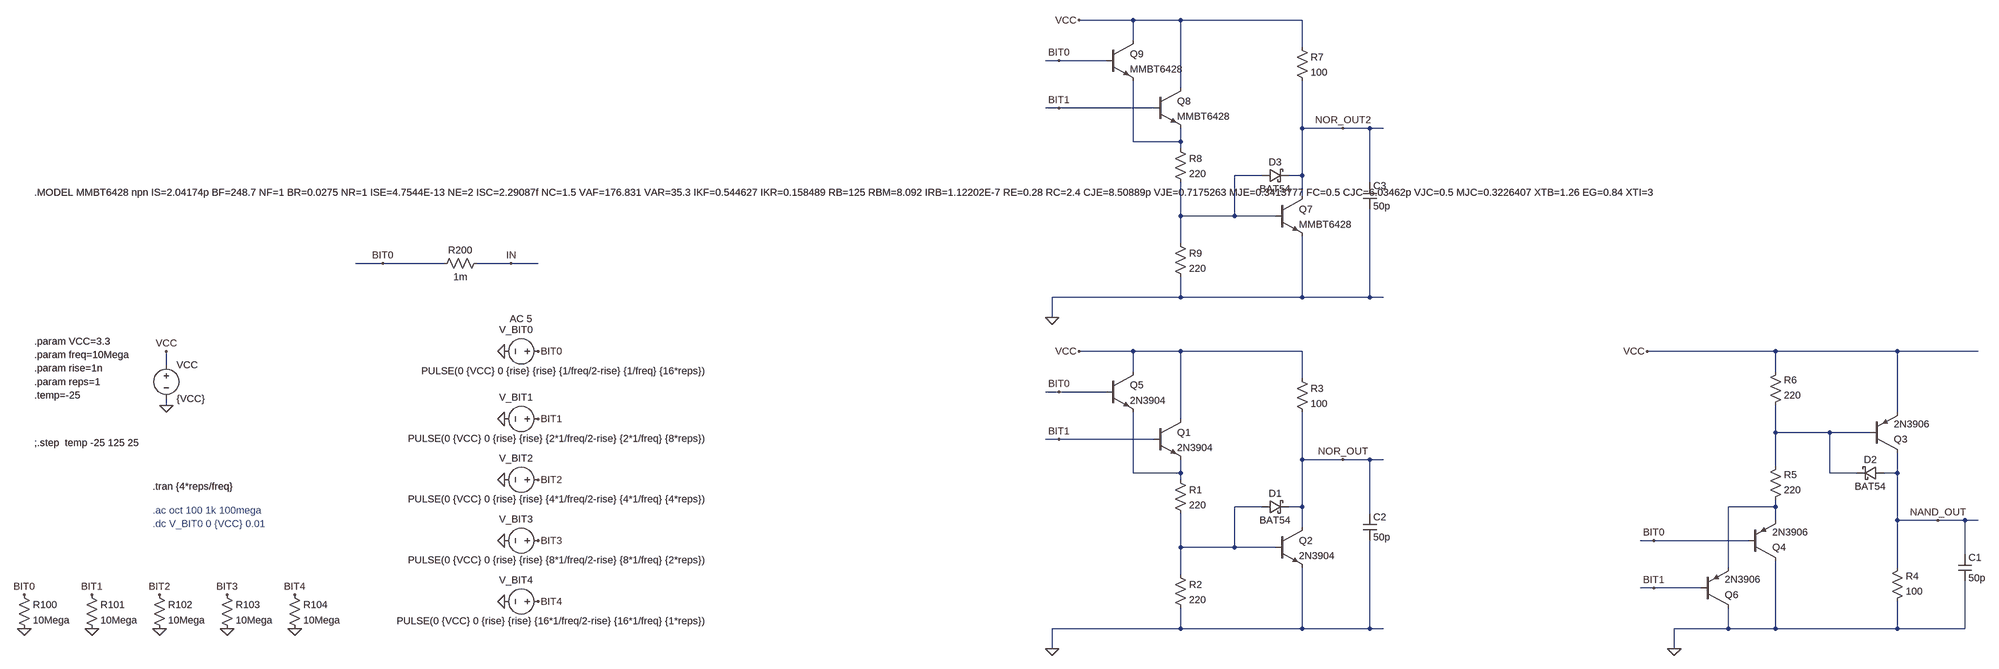
[diagram p0: schematic nand_nor.asc]
nand_nor.asc, the LTspice schematic file:
Version 4
SHEET 1 14868 10612
WIRE 1536 96 1408 96
WIRE 1648 96 1536 96
WIRE 1936 96 1648 96
WIRE 1536 144 1536 96
WIRE 1936 160 1936 96
WIRE 1360 192 1328 192
WIRE 1472 192 1360 192
WIRE 1648 256 1648 96
WIRE 1360 304 1328 304
WIRE 1584 304 1360 304
WIRE 1936 352 1936 240
WIRE 2032 352 1936 352
WIRE 2096 352 2032 352
WIRE 2128 352 2096 352
WIRE 1536 384 1536 240
WIRE 1648 384 1648 352
WIRE 1648 384 1536 384
WIRE 1648 400 1648 384
WIRE 1840 464 1776 464
WIRE 1936 464 1936 352
WIRE 1936 464 1904 464
WIRE 2096 480 2096 352
WIRE 1936 512 1936 464
WIRE 1648 560 1648 480
WIRE 1776 560 1776 464
WIRE 1776 560 1648 560
WIRE 1872 560 1776 560
WIRE 1648 624 1648 560
WIRE -240 672 -304 672
WIRE -96 672 -240 672
WIRE 64 672 -16 672
WIRE 128 672 64 672
WIRE 1648 752 1648 704
WIRE 1648 752 1344 752
WIRE 1936 752 1936 608
WIRE 1936 752 1648 752
WIRE 2096 752 2096 544
WIRE 2096 752 1936 752
WIRE 2128 752 2096 752
WIRE 1344 800 1344 752
WIRE 1536 880 1408 880
WIRE 1648 880 1536 880
WIRE 1936 880 1648 880
WIRE 3056 880 2752 880
WIRE 3344 880 3056 880
WIRE 3536 880 3344 880
WIRE -752 912 -752 880
WIRE 1536 928 1536 880
WIRE 3056 928 3056 880
WIRE 1936 944 1936 880
WIRE 1360 976 1328 976
WIRE 1472 976 1360 976
WIRE -752 1008 -752 992
WIRE 3344 1024 3344 880
WIRE 1648 1040 1648 880
WIRE 3056 1072 3056 1008
WIRE 3184 1072 3056 1072
WIRE 3280 1072 3184 1072
WIRE 1360 1088 1328 1088
WIRE 1584 1088 1360 1088
WIRE 1936 1136 1936 1024
WIRE 2032 1136 1936 1136
WIRE 2096 1136 2032 1136
WIRE 2128 1136 2096 1136
WIRE 3056 1152 3056 1072
WIRE 1536 1168 1536 1024
WIRE 1648 1168 1648 1136
WIRE 1648 1168 1536 1168
WIRE 3184 1168 3184 1072
WIRE 3248 1168 3184 1168
WIRE 3344 1168 3344 1120
WIRE 3344 1168 3312 1168
WIRE 1648 1184 1648 1168
WIRE 1840 1248 1776 1248
WIRE 1936 1248 1936 1136
WIRE 1936 1248 1904 1248
WIRE 3056 1248 3056 1232
WIRE 3056 1248 2944 1248
WIRE 2096 1264 2096 1136
WIRE 3056 1280 3056 1248
WIRE 3344 1280 3344 1168
WIRE 3440 1280 3344 1280
WIRE 3504 1280 3440 1280
WIRE 3536 1280 3504 1280
WIRE 1936 1296 1936 1248
WIRE 2768 1328 2736 1328
WIRE 2992 1328 2768 1328
WIRE 1648 1344 1648 1264
WIRE 1776 1344 1776 1248
WIRE 1776 1344 1648 1344
WIRE 1872 1344 1776 1344
WIRE 3504 1360 3504 1280
WIRE 2944 1392 2944 1248
WIRE 3344 1392 3344 1280
WIRE 1648 1408 1648 1344
WIRE 2768 1440 2736 1440
WIRE 2880 1440 2768 1440
WIRE 1648 1536 1648 1488
WIRE 1648 1536 1344 1536
WIRE 1936 1536 1936 1392
WIRE 1936 1536 1648 1536
WIRE 2096 1536 2096 1328
WIRE 2096 1536 1936 1536
WIRE 2128 1536 2096 1536
WIRE 2944 1536 2944 1488
WIRE 2944 1536 2816 1536
WIRE 3056 1536 3056 1376
WIRE 3056 1536 2944 1536
WIRE 3344 1536 3344 1472
WIRE 3344 1536 3056 1536
WIRE 3504 1536 3504 1424
WIRE 3504 1536 3344 1536
WIRE 1344 1584 1344 1536
WIRE 2816 1584 2816 1536
FLAG -752 1008 0
FLAG 128 880 BIT0
FLAG -752 880 VCC
FLAG 48 880 0
FLAG 128 1040 BIT1
FLAG 48 1040 0
FLAG 128 1184 BIT2
FLAG 48 1184 0
FLAG 128 1328 BIT3
FLAG 48 1328 0
FLAG 128 1472 BIT4
FLAG 48 1472 0
FLAG -1088 1456 BIT0
FLAG -1088 1536 0
FLAG -928 1456 BIT1
FLAG -928 1536 0
FLAG -768 1456 BIT2
FLAG -768 1536 0
FLAG -608 1456 BIT3
FLAG -608 1536 0
FLAG -448 1456 BIT4
FLAG -448 1536 0
FLAG 1344 1584 0
FLAG 2032 1136 NOR_OUT
FLAG 1360 1088 BIT1
FLAG 1408 880 VCC
FLAG -240 672 BIT0
FLAG 64 672 IN
FLAG 2816 1584 0
FLAG 3440 1280 NAND_OUT
FLAG 2768 1328 BIT0
FLAG 2752 880 VCC
FLAG 1360 976 BIT0
FLAG 2768 1440 BIT1
FLAG 1344 800 0
FLAG 2032 352 NOR_OUT2
FLAG 1360 304 BIT1
FLAG 1408 96 VCC
FLAG 1360 192 BIT0
SYMBOL voltage -752 896 R0
WINDOW 123 0 0 Left 0
WINDOW 39 0 0 Left 0
SYMATTR InstName VCC
SYMATTR Value {VCC}
SYMBOL voltage 144 880 R90
WINDOW 123 -77 30 VRight 2
WINDOW 39 0 0 Left 0
WINDOW 0 -51 28 VRight 2
WINDOW 3 46 -379 VRight 2
SYMATTR Value2 AC 5
SYMATTR InstName V_BIT0
SYMATTR Value PULSE(0 {VCC} 0 {rise} {rise} {1/freq/2-rise} {1/freq} {16*reps})
SYMBOL voltage 144 1040 R90
WINDOW 123 -77 30 VRight 2
WINDOW 39 0 0 Left 0
WINDOW 0 -51 28 VRight 2
WINDOW 3 46 -379 VRight 2
SYMATTR InstName V_BIT1
SYMATTR Value PULSE(0 {VCC} 0 {rise} {rise} {2*1/freq/2-rise} {2*1/freq} {8*reps})
SYMBOL voltage 144 1184 R90
WINDOW 123 -77 30 VRight 2
WINDOW 39 0 0 Left 0
WINDOW 0 -51 28 VRight 2
WINDOW 3 46 -379 VRight 2
SYMATTR InstName V_BIT2
SYMATTR Value PULSE(0 {VCC} 0 {rise} {rise} {4*1/freq/2-rise} {4*1/freq} {4*reps})
SYMBOL voltage 144 1328 R90
WINDOW 123 -77 30 VRight 2
WINDOW 39 0 0 Left 0
WINDOW 0 -51 28 VRight 2
WINDOW 3 46 -379 VRight 2
SYMATTR InstName V_BIT3
SYMATTR Value PULSE(0 {VCC} 0 {rise} {rise} {8*1/freq/2-rise} {8*1/freq} {2*reps})
SYMBOL voltage 144 1472 R90
WINDOW 123 -77 30 VRight 2
WINDOW 39 0 0 Left 0
WINDOW 0 -51 28 VRight 2
WINDOW 3 46 -379 VRight 2
SYMATTR InstName V_BIT4
SYMATTR Value PULSE(0 {VCC} 0 {rise} {rise} {16*1/freq/2-rise} {16*1/freq} {1*reps})
SYMBOL res -1104 1440 R0
SYMATTR InstName R100
SYMATTR Value 10Mega
SYMBOL res -944 1440 R0
SYMATTR InstName R101
SYMATTR Value 10Mega
SYMBOL res -784 1440 R0
SYMATTR InstName R102
SYMATTR Value 10Mega
SYMBOL res -624 1440 R0
SYMATTR InstName R103
SYMATTR Value 10Mega
SYMBOL res -464 1440 R0
SYMATTR InstName R104
SYMATTR Value 10Mega
SYMBOL npn 1872 1296 R0
SYMATTR InstName Q2
SYMATTR Value 2N3904
SYMBOL schottky 1840 1264 R270
WINDOW 0 32 32 VTop 2
WINDOW 3 0 32 VBottom 2
SYMATTR InstName D1
SYMATTR Value BAT54
SYMATTR Description Diode
SYMATTR Type diode
SYMBOL npn 1584 1040 R0
SYMATTR InstName Q1
SYMATTR Value 2N3904
SYMBOL res 1920 928 R0
SYMATTR InstName R3
SYMATTR Value 100
SYMBOL res 1632 1168 R0
SYMATTR InstName R1
SYMATTR Value 220
SYMBOL res 1632 1392 R0
SYMATTR InstName R2
SYMATTR Value 220
SYMBOL res 0 656 R90
WINDOW 0 0 56 VBottom 2
WINDOW 3 32 56 VTop 2
SYMATTR InstName R200
SYMATTR Value 1m
SYMBOL cap 2080 1264 R0
SYMATTR InstName C2
SYMATTR Value 50p
SYMBOL schottky 3312 1184 M270
WINDOW 0 32 32 VTop 2
WINDOW 3 0 32 VBottom 2
SYMATTR InstName D2
SYMATTR Value BAT54
SYMATTR Description Diode
SYMATTR Type diode
SYMBOL res 3328 1488 M180
WINDOW 0 36 76 Left 2
WINDOW 3 36 40 Left 2
SYMATTR InstName R4
SYMATTR Value 100
SYMBOL res 3040 1248 M180
WINDOW 0 36 76 Left 2
WINDOW 3 36 40 Left 2
SYMATTR InstName R5
SYMATTR Value 220
SYMBOL res 3040 1024 M180
WINDOW 0 36 76 Left 2
WINDOW 3 36 40 Left 2
SYMATTR InstName R6
SYMATTR Value 220
SYMBOL cap 3488 1424 M180
WINDOW 0 24 56 Left 2
WINDOW 3 24 8 Left 2
SYMATTR InstName C1
SYMATTR Value 50p
SYMBOL pnp 3280 1120 M180
SYMATTR InstName Q3
SYMATTR Value 2N3906
SYMBOL pnp 2992 1376 M180
SYMATTR InstName Q4
SYMATTR Value 2N3906
SYMBOL npn 1472 928 R0
SYMATTR InstName Q5
SYMATTR Value 2N3904
SYMBOL pnp 2880 1488 M180
SYMATTR InstName Q6
SYMATTR Value 2N3906
SYMBOL npn 1872 512 R0
SYMATTR InstName Q7
SYMATTR Value MMBT6428
SYMBOL schottky 1840 480 R270
WINDOW 0 32 32 VTop 2
WINDOW 3 0 32 VBottom 2
SYMATTR InstName D3
SYMATTR Value BAT54
SYMATTR Description Diode
SYMATTR Type diode
SYMBOL npn 1584 256 R0
SYMATTR InstName Q8
SYMATTR Value MMBT6428
SYMBOL res 1920 144 R0
SYMATTR InstName R7
SYMATTR Value 100
SYMBOL res 1632 384 R0
SYMATTR InstName R8
SYMATTR Value 220
SYMBOL res 1632 608 R0
SYMATTR InstName R9
SYMATTR Value 220
SYMBOL cap 2080 480 R0
SYMATTR InstName C3
SYMATTR Value 50p
SYMBOL npn 1472 144 R0
SYMATTR InstName Q9
SYMATTR Value MMBT6428
TEXT -784 1200 Left 2 !.tran {4*reps/freq}
TEXT -784 1256 Left 2 ;.ac oct 100 1k 100mega
TEXT -784 1288 Left 2 ;.dc V_BIT0 0 {VCC} 0.01
TEXT -1064 856 Left 2 !.param VCC=3.3
TEXT -1064 888 Left 2 !.param freq=10Mega
TEXT -1064 920 Left 2 !.param rise=1n
TEXT -1064 952 Left 2 !.param reps=1
TEXT -1064 1096 Left 2 !;.step  temp -25 125 25
TEXT -1064 984 Left 2 !.temp=-25
TEXT -1064 504 Left 2 !.MODEL MMBT6428 npn IS=2.04174p BF=248.7 NF=1 BR=0.0275 NR=1 ISE=4.7544E-13 NE=2 ISC=2.29087f NC=1.5 VAF=176.831 VAR=35.3 IKF=0.544627 IKR=0.158489 RB=125 RBM=8.092 IRB=1.12202E-7 RE=0.28 RC=2.4 CJE=8.50889p VJE=0.7175263 MJE=0.3413777 FC=0.5 CJC=6.03462p VJC=0.5 MJC=0.3226407 XTB=1.26 EG=0.84 XTI=3 TF=8.73n Vceo=50 Icrating=0.5 mfg=fairchild)

The netlist it stands for:
* nand_nor.asc
VCC VCC 0 {VCC}
V_BIT0 BIT0 0 PULSE(0 {VCC} 0 {rise} {rise} {1/freq/2-rise} {1/freq} {16*reps}) AC 5
V_BIT1 BIT1 0 PULSE(0 {VCC} 0 {rise} {rise} {2*1/freq/2-rise} {2*1/freq} {8*reps})
V_BIT2 BIT2 0 PULSE(0 {VCC} 0 {rise} {rise} {4*1/freq/2-rise} {4*1/freq} {4*reps})
V_BIT3 BIT3 0 PULSE(0 {VCC} 0 {rise} {rise} {8*1/freq/2-rise} {8*1/freq} {2*reps})
V_BIT4 BIT4 0 PULSE(0 {VCC} 0 {rise} {rise} {16*1/freq/2-rise} {16*1/freq} {1*reps})
R100 BIT0 0 10Mega
R101 BIT1 0 10Mega
R102 BIT2 0 10Mega
R103 BIT3 0 10Mega
R104 BIT4 0 10Mega
Q2 NOR_OUT N005 0 0 2N3904
D1 N005 NOR_OUT BAT54
Q1 VCC BIT1 N004 0 2N3904
R3 VCC NOR_OUT 100
R1 N004 N005 220
R2 N005 0 220
R200 IN BIT0 1m
C2 NOR_OUT 0 50p
D2 NAND_OUT N003 BAT54
R4 0 NAND_OUT 100
R5 N006 N003 220
R6 N003 VCC 220
C1 0 NAND_OUT 50p
Q3 NAND_OUT N003 VCC 0 2N3906
Q4 0 BIT0 N006 0 2N3906
Q5 VCC BIT0 N004 0 2N3904
Q6 0 BIT1 N006 0 2N3906
Q7 NOR_OUT2 N002 0 0 MMBT6428
D3 N002 NOR_OUT2 BAT54
Q8 VCC BIT1 N001 0 MMBT6428
R7 VCC NOR_OUT2 100
R8 N001 N002 220
R9 N002 0 220
C3 NOR_OUT2 0 50p
Q9 VCC BIT0 N001 0 MMBT6428
.model D D
.lib standard.dio
.model NPN NPN
.model PNP PNP
.lib standard.bjt
.tran {4*reps/freq}
* .ac oct 100 1k 100mega
* .dc V_BIT0 0 {VCC} 0.01
.param VCC=3.3
.param freq=10Mega
.param rise=1n
.param reps=1
;.step  temp -25 125 25
.temp=-25
.MODEL MMBT6428 npn IS=2.04174p BF=248.7 NF=1 BR=0.0275 NR=1 ISE=4.7544E-13 NE=2 ISC=2.29087f NC=1.5 VAF=176.831 VAR=35.3 IKF=0.544627 IKR=0.158489 RB=125 RBM=8.092 IRB=1.12202E-7 RE=0.28 RC=2.4 CJE=8.50889p VJE=0.7175263 MJE=0.3413777 FC=0.5 CJC=6.03462p VJC=0.5 MJC=0.3226407 XTB=1.26 EG=0.84 XTI=3 TF=8.73n Vceo=50 Icrating=0.5 mfg=fairchild)
.backanno
.end